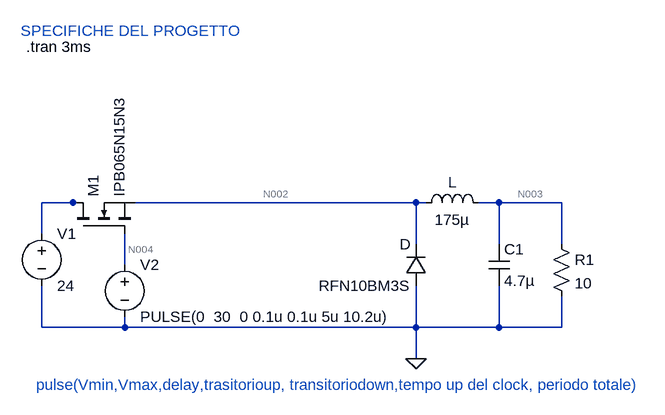
[diagram p0: schematic buck reale.asc]
buck reale.asc, the LTspice schematic file:
Version 4
SHEET 1 880 680
WIRE -288 -32 -336 -32
WIRE -272 -32 -288 -32
WIRE 240 -32 -192 -32
WIRE 256 -32 240 -32
WIRE 368 -32 336 -32
WIRE 464 -32 368 -32
WIRE -336 16 -336 -32
WIRE 240 32 240 -32
WIRE 368 32 368 -32
WIRE 464 32 464 -32
WIRE -208 64 -208 16
WIRE -336 160 -336 96
WIRE -208 160 -208 144
WIRE -208 160 -336 160
WIRE 240 160 240 96
WIRE 240 160 -208 160
WIRE 368 160 368 96
WIRE 368 160 240 160
WIRE 464 160 464 112
WIRE 464 160 368 160
WIRE 240 208 240 160
FLAG 240 208 0
SYMBOL cap 352 32 R0
SYMATTR InstName C1
SYMATTR Value 4.7µ
SYMBOL ind 240 -16 R270
WINDOW 0 32 56 VTop 2
WINDOW 3 5 56 VBottom 2
SYMATTR InstName L
SYMATTR Value 175µ
SYMBOL res 448 16 R0
SYMATTR InstName R1
SYMATTR Value 10
SYMBOL voltage -336 0 R0
WINDOW 123 0 0 Left 0
WINDOW 39 0 0 Left 0
SYMATTR InstName V1
SYMATTR Value 24
SYMBOL voltage -208 48 R0
WINDOW 123 0 0 Left 0
WINDOW 39 0 0 Left 0
SYMATTR InstName V2
SYMATTR Value PULSE(0  30  0 0.1u 0.1u 5u 10.2u)
SYMBOL nmos -288 16 R270
SYMATTR InstName M1
SYMATTR Value IPB065N15N3
SYMBOL diode 256 96 R180
WINDOW 0 24 64 Left 2
WINDOW 3 24 0 Left 2
SYMATTR InstName D
SYMATTR Value RFN10BM3S
SYMATTR Description Schottky diode
SYMATTR Type schottky
TEXT -360 -272 Left 2 !.tran 3ms
TEXT -368 -296 Left 2 ;SPECIFICHE DEL PROGETTO
TEXT -344 248 Left 2 ;pulse(Vmin,Vmax,delay,trasitorioup, transitoriodown,tempo up del clock, periodo totale)

The netlist it stands for:
* buck reale.asc
C1 N003 0 4.7µ
L N002 N003 175µ
R1 N003 0 10
V1 N001 0 24
V2 N004 0 PULSE(0  30  0 0.1u 0.1u 5u 10.2u)
M1 N001 N004 N002 N002 IPB065N15N3
D 0 N002 RFN10BM3S
.model D D
.lib standard.dio
.model NMOS NMOS
.model PMOS PMOS
.lib standard.mos
.tran 3ms
* SPECIFICHE DEL PROGETTO
* pulse(Vmin,Vmax,delay,trasitorioup, transitoriodown,tempo up del clock, periodo totale)
.backanno
.end

* Results of the author's LTspice run, read from the files saved beside the schematic
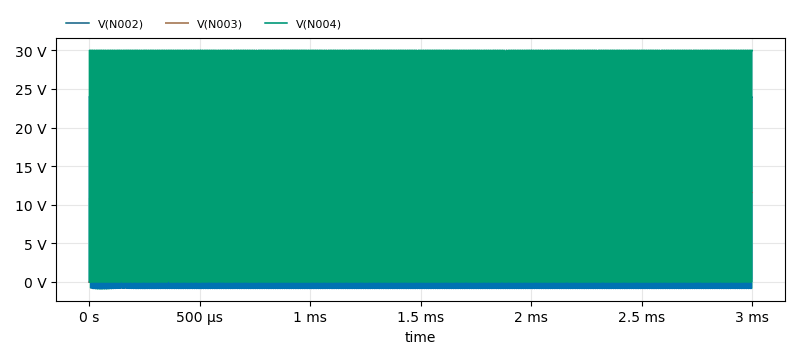
[diagram p1: Transient Analysis of buck reale.asc, plotted from the saved traces]
* Transient Analysis, 1 run:
*   V(N002): min -888.6 mV, max 24.01 V, average 11.58 V, rms 16.92 V, last 23.99 V
*   V(N003): min 0 V, max 15.82 V, average 11.51 V, rms 11.57 V, last 11.53 V
*   V(N004): min 0 V, max 30 V, average 15.01 V, rms 21.15 V, last 30 V